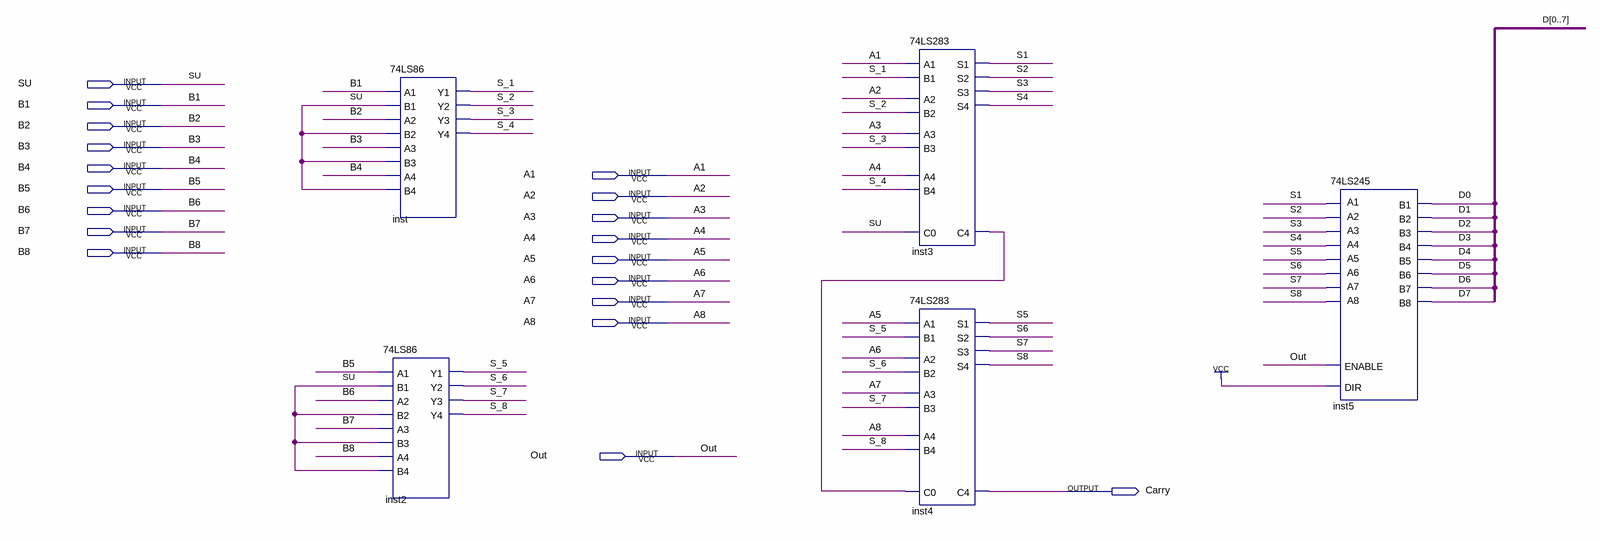
[diagram p0: schematic sheet]
// Quartus schematic Ula.bdf as structural Verilog: 5 symbols, 19 pins
module Ula (
  input  SU,
  input  B1,
  input  B2,
  input  B3,
  input  B4,
  input  A1,
  input  B5,
  input  A2,
  input  B6,
  input  A3,
  input  B7,
  input  A4,
  input  B8,
  input  A5,
  input  A6,
  input  A7,
  input  A8,
  input  Out,
  output Carry
);

  wire inst3_c4, S1, S2, S3, S4, S5, S6, S7, S8, S_1, S_2, S_3, S_4, S_5, S_6, S_7, S_8;
  wire [7:0] D;

  \74LS86  inst (
    .A1(B1), .B1(SU), .A2(B2), .B2(SU), .A3(B3), .B3(SU), .A4(B4), .B4(SU), .Y1(S_1), .Y2(S_2), .Y3(S_3),
    .Y4(S_4));
  \74LS86  inst2 (
    .A1(B5), .B1(SU), .A2(B6), .B2(SU), .A3(B7), .B3(SU), .A4(B8), .B4(SU), .Y1(S_5), .Y2(S_6), .Y3(S_7),
    .Y4(S_8));
  \74LS283  inst3 (
    .A3(A3), .B3(S_3), .A4(A4), .B4(S_4), .B2(S_2), .A2(A2), .C0(SU), .A1(A1), .B1(S_1), .S1(S1), .S2(S2),
    .S3(S3), .S4(S4), .C4(inst3_c4));
  \74LS283  inst4 (
    .A3(A7), .B3(S_7), .A4(A8), .B4(S_8), .B2(S_6), .A2(A6), .C0(inst3_c4), .A1(A5), .B1(S_5), .S1(S5),
    .S2(S6), .S3(S7), .S4(S8), .C4(Carry));
  \74LS245  inst5 (
    .ENABLE(Out), .DIR(1'b1), .B1(D[0]), .B2(D[1]), .B3(D[2]), .B4(D[3]), .B5(D[4]), .B6(D[5]), .B7(D[6]),
    .B8(D[7]), .A1(S1), .A2(S2), .A3(S3), .A4(S4), .A5(S5), .A6(S6), .A7(S7), .A8(S8));
endmodule
